# EAGLE schematic deska (EAGLE 6.5.0)
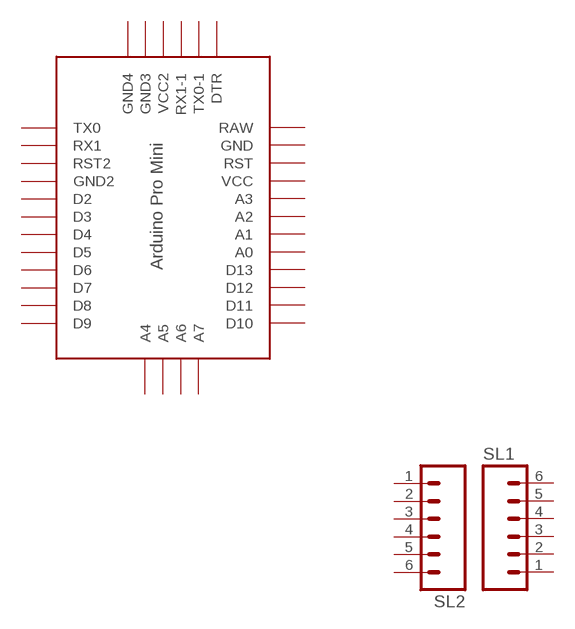
[diagram p0: schematic, sheet 1]

## Parts
SL1  M06  [06P]
SL2  M06  [06P]
U$1  PRO-MINI  [PRO-MINI]
Unconnected: SL1.1 SL1.2 SL1.3 SL1.4 SL1.5 SL1.6 SL2.1 SL2.2 SL2.3 SL2.4 SL2.5 SL2.6 U$1.A0 U$1.A1 U$1.A2 U$1.A3 U$1.A4 U$1.A5 U$1.A6 U$1.A7 U$1.D2 U$1.D3 U$1.D4 U$1.D5 U$1.D6 U$1.D7 U$1.D8 U$1.D9 U$1.D10 U$1.D11 U$1.D12 U$1.D13 U$1.DTR U$1.GND U$1.GND1(GND2) U$1.GND2(GND4) U$1.GND3 U$1.RST U$1.RST1(RST2) U$1.RX1 U$1.RX1-1 U$1.TX0 U$1.TX0-1 U$1.VCC U$1.VCC1(VCC2)

## Power pins joined to a net without a drawn wire
RAW: U$1.RAW

## Library data of the parts
SL1 SL2 = con-amp-quick:M06: AMP QUICK CONNECTOR; OC_FARNELL: unknown; OC_NEWARK: unknown
U$1 = Arduino-clone:PRO-MINI: Arduion Pro Mini Clone V1.0 www.betemcu.cu